# Altium schematic sheet Battery_2CELL.SchDoc
size A4
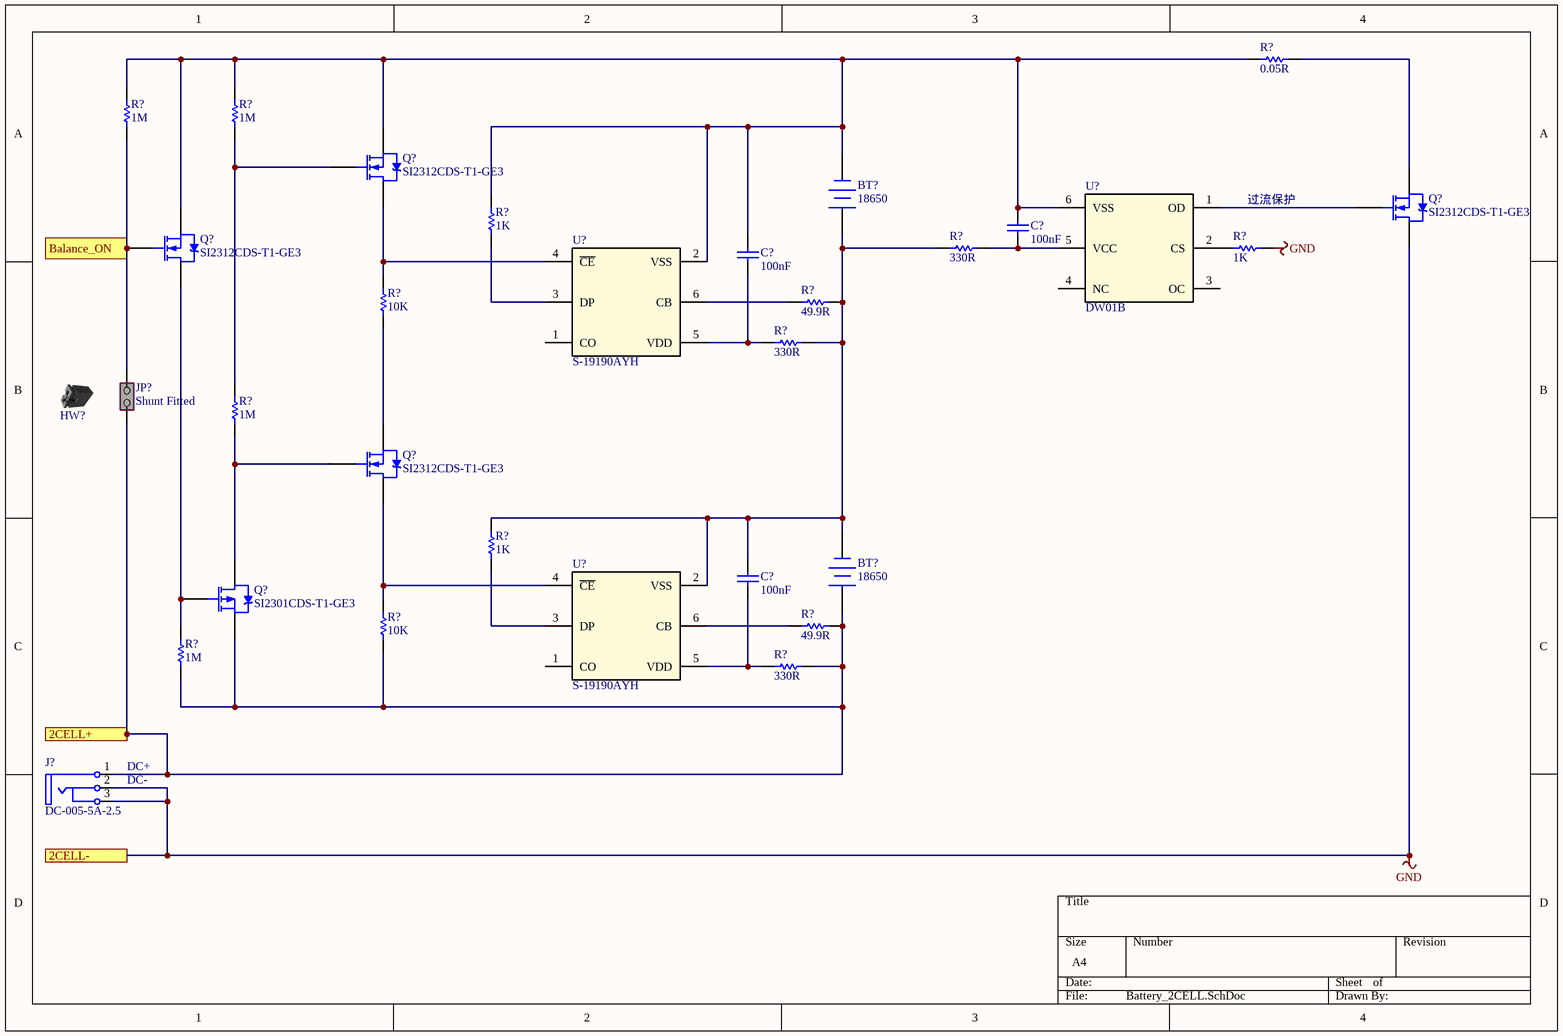
[diagram p0: Battery_2CELL.SchDoc]

## Parts
(Parts that share a designator on the sheet are numbered #1, #2 ... from top to bottom, then left to right.)
BT?#1  18650  [DIP-18650]
BT?#2  18650  [DIP-18650]
C?#1  100nF  [S0603C]
C?#2  100nF  [S0603C]
C?#3  100nF  [S0603C]
HW?  SHUNT  (value not drawn)  (mechanical)
J?  DC-005-5A-2.5  [DC-5.5X2.5]
JP?  Shunt Fitted  [CON_SAMTEC_TSW-102-07-G-S]
Q?#1  SI2312CDS-T1-GE3  [SOT-23(SOT-23-3)]
Q?#2  SI2312CDS-T1-GE3  [SOT-23(SOT-23-3)]
Q?#3  SI2312CDS-T1-GE3  [SOT-23(SOT-23-3)]
Q?#4  SI2312CDS-T1-GE3  [SOT-23(SOT-23-3)]
Q?#5  SI2301CDS-T1-GE3  [SOT-23(SOT-23-3)]
R?#1  0.05R  [S0805R]
R?#2  1M  [S0603R]
R?#3  1M  [S0603R]
R?#4  1K  [S0603R]
R?#5  330R  [S0603R]
R?#6  1K  [S0603R]
R?#7  10K  [S0603R]
R?#8  49.9R  [R1812]
R?#9  330R  [S0603R]
R?#10  1M  [S0603R]
R?#11  1K  [S0603R]
R?#12  10K  [S0603R]
R?#13  49.9R  [R1812]
R?#14  1M  [S0603R]
R?#15  330R  [S0603R]
U?#1  DW01B  [USOT23-6]
U?#2  S-19190AYH  [USOT23-6]
U?#3  S-19190AYH  [USOT23-6]

## Ports
2CELL+, 2CELL-, Balance_ON

## Nets
GND: J?.2(DC-) J?.3(DC-) Q?#2.3(D) R?#6.2 ; port 2CELL-
2CELL+: BT?#2.1(+) J?.1(DC+) JP?.1(COMMON) Q?#5.2(S) R?#12.1 R?#13.2 R?#14.1 R?#15.1 ; port 2CELL+
Balance_ON: JP?.2(NO) Q?#3.1(G) R?#2.1 ; port Balance_ON
NetBT?#1_1: BT?#1.1(+) BT?#2.2(-) C?#3.2 R?#5.1 R?#8.2 R?#9.1 R?#11.2 U?#3.2(VSS)
NetBT?#1_2: BT?#1.2(-) C?#1.1 C?#2.2 Q?#1.2(S) Q?#3.2(S) R?#1.1 R?#2.2 R?#3.2 R?#4.2 U?#1.6(VSS) U?#2.2(VSS)
NetC?#1_2: C?#1.2 R?#5.2 U?#1.5(VCC)
NetC?#2_1: C?#2.1 R?#9.2 U?#2.5(VDD)
NetC?#3_1: C?#3.1 R?#15.2 U?#3.5(VDD)
NetQ?#1_1: Q?#1.1(G) R?#3.1 R?#10.2
NetQ?#1_3: Q?#1.3(D) R?#7.2 U?#2.4(~{CE})
NetQ?#2_1: Q?#2.1(G) U?#1.1(OD)
NetQ?#2_2: Q?#2.2(S) R?#1.2
NetQ?#3_3: Q?#3.3(D) Q?#5.1(G) R?#14.2
NetQ?#4_1: Q?#4.1(G) Q?#5.3(D) R?#10.1
NetQ?#4_2: Q?#4.2(S) R?#7.1
NetQ?#4_3: Q?#4.3(D) R?#12.2 U?#3.4(~{CE})
NetR?#4_1: R?#4.1 U?#2.3(DP)
NetR?#6_1: R?#6.1 U?#1.2(CS)
NetR?#8_1: R?#8.1 U?#2.6(CB)
NetR?#11_1: R?#11.1 U?#3.3(DP)
NetR?#13_1: R?#13.1 U?#3.6(CB)

Not connected (* = marked no-connect by the designer): U?#1 3(OC) 4(NC); U?#2 1(CO); U?#3 1(CO)

## Notes on the sheet
- 过流保护
- (near J?) DC+
- (near J?) DC-

## Library data of the parts
BT?#1 BT?#2 = Battery_18650_DIP: 18650单节直插电池仓; CompType: 电池盒/电池座; Code: DIP-18650; DistributorCode: -; Manufacturer: -; Package: DIP; A_Code: -; A_ComType: -; A_Manufacturer: -
C?#1-C?#3 = 100nF/0603/50V: 精度 ±10% / 容值 100nF / 额定电压 50V / 温漂系数（介质材料) X7R; Manufacturer: FH(风华); A_Manufacturer: 元六; Code: 0603B104K500NT; A_Code: J CT41-0603-2R1-50V-104K; CompType: Capacitor; A_ComType: 二类电容; DistributorCode: C30926; Package: 0603
HW? = SHUNT: SHUNT 2.54mm BLACK; Internal_Part_Number: MCD-00043; Manufacturer_Part_Number: SNT-100-BK-G; Manufacturer: SAMTEC; Part_Type: Mechanical; Provided_By: Subcon; Initial_Board_Reference: MB1274; ECCN_US: n/a; ECCN_EU: n/a; ComponentLink1Description: Samtec_Shunt_Jumper_SNT100.pdf; Status: Released; ComponentLink1URL: http://tunmcdsvn.tun.st.com/Component_Datasheet_Library/Trunk/Connectors/Samtec_Shunt_Jumper_SNT100
J? = DC-005-5A-2.5: 连接器类型 插孔 / 触点外径 6.5mm / 安装特性 - / 电流额定值 5A / 产品类型 DC电源插座 / 公母 公头 / 安装类型 通孔，直角 / 触点内径 2.5mm / 电压额定值 24V; Manufacturer: XKB Connectivity(中国星坤); CompType: 连接器; Code: DC-005-5A-2.5; DistributorCode: C381115; Package: DC电源插座; A_Code: -; A_ComType: -; A_Manufacturer: -
JP? = MCD-00683: Header, 2x1, 2,54mm, VR, TH, Height 5.84mm/2.54mm - Shunt Fitted by default; Part_Type: Connector; Manufacturer_Part_Number: TSW-102-07-x-S; Manufacturer: SAMTEC; Provided_By: Subcon; Initial_Board_Reference: MB1331; Internal_Part_Number: MCD-00683; Status: Released; ComponentLink1Description: Samtec_connector_TSW-HTSW-series.pdf; ComponentLink1URL: http://tunmcdsvn.tun.st.com/Component_Datasheet_Library/Trunk/Connectors/Samtec_TSW-HTSW-series; ECCN_US: n/a; ECCN_EU: n/a; Value: Shunt Fitted
Q?#1-Q?#4 = SI2312CDS-T1-GE3: 漏源电压（Vdss） 20V / 连续漏极电流（Id）（25°C 时） 6A(Tc) / 栅源极阈值电压 1V @ 250uA / 漏源导通电阻 31.8mΩ @ 5A,4.5V / 最大功率耗散（Ta=25°C） 2.1W(Tc) / 类型 N沟道; Manufacturer: VISHAY(威世); CompType: MOS(场效应管); A_Code: -; A_Manufacturer: -; Code: SI2312CDS-T1-GE3; DistributorCode: C142518; Package: SOT-23-3; A_ComType: -
Q?#5 = SI2301CDS-T1-GE3: 漏源电压（Vdss） -20V / 连续漏极电流（Id）（25°C 时） 3.1A / 栅源极阈值电压 1V @ 250uA / 漏源导通电阻 112mΩ @ 2.8A,4.5V / 最大功率耗散（Ta=25°C） 860mW / 类型 P沟道; Manufacturer: VISHAY(威世); CompType: MOS(场效应管); A_Code: -; A_Manufacturer: -; Code: SI2301CDS-T1-GE3; DistributorCode: C10487; Package: SOT-23-3; A_ComType: -
R?#1 = 0.05R/0805: 阻值（欧姆） 0.05Ω / 精度 ±1% / 功率 1/4W / 温度系数 ±400ppm/°C; Manufacturer: UNI-ROYAL(厚声); A_Manufacturer: 718; Code: CS05W4F500MT5E; CompType: Resistor; A_ComType: RM型片式膜固定电阻器; DistributorCode: C270863; Package: 0805; A_Code: -
R?#2 R?#3 R?#10 R?#14 = 1M/0603: 阻值 1MΩ / 精度 ±1% / 温度系数 ±100ppm/℃ / 功率 0.1W /; Manufacturer: FH(风华); A_Manufacturer: 718; Code: RS-03K1004FT; A_Code: J-RM1608(0603)-K-B-1M-F; CompType: Resistor; A_ComType: RM型片式膜固定电阻器; DistributorCode: C136593; Package: 0603
R?#4 R?#6 R?#11 = 1K/0603: 精度 ±1% / 温度系数 ±100ppm/℃ / 阻值 1kΩ / 功率 0.1W; Manufacturer: FH(风华); A_Manufacturer: 718; Code: RS-03K1001FT; A_Code: J-RM1608(0603)-K-B-1K-F; CompType: Resistor; A_ComType: RM型片式膜固定电阻器; DistributorCode: C115325; Package: 0603
R?#5 R?#9 R?#15 = 330R/0603: 精度 ±1% / 温度系数 ±100ppm/℃ / 阻值 330Ω / 功率 0.1W; Manufacturer: FH(风华); A_Manufacturer: 718; Code: RS-03K3300FT; A_Code: J-RM1608(0603)-K-B-330R-F; CompType: Resistor; A_ComType: RM型片式膜固定电阻器; DistributorCode: C125768; Package: 0603
R?#7 R?#12 = 10K/0603: 精度 ±1% / 温度系数 ±100ppm/℃ / 阻值 10kΩ / 功率 0.1W; Manufacturer: FH(风华); A_Manufacturer: 718; Code: RS-03K1002FT; A_Code: J-RM1608(0603)-K-B-10K-F; CompType: Resistor; A_ComType: RM型片式膜固定电阻器; DistributorCode: C115324; Package: 0603
R?#8 R?#13 = 49.9R/1812: 精度 ±1% / 功率 0.75W / 温度系数 ±100ppm/℃ / 阻值 49.9Ω; Manufacturer: UNI-ROYAL(厚声); A_Manufacturer: 718; Code: 181207F499JT4E; CompType: Resistor; A_ComType: RM型片式膜固定电阻器; DistributorCode: C422079; Package: 0805; A_Code: -
U?#1 = DW01B: Manufacturer: BLUE ROCKET(蓝箭); CompType: 电池保护芯片; Code: DW01B; DistributorCode: C305480; Package: SOT23-6
U?#2 U?#3 = S-19190AYH: 均衡电压4.15V;过充电压4.275V; Manufacturer: 艾普凌科; CompType: 电池保护芯片; Code: S-19190AYH; DistributorCode: -; Package: SOT23-6